# EAGLE design nRF_Wifi_Relay (EAGLE 6.5.0)
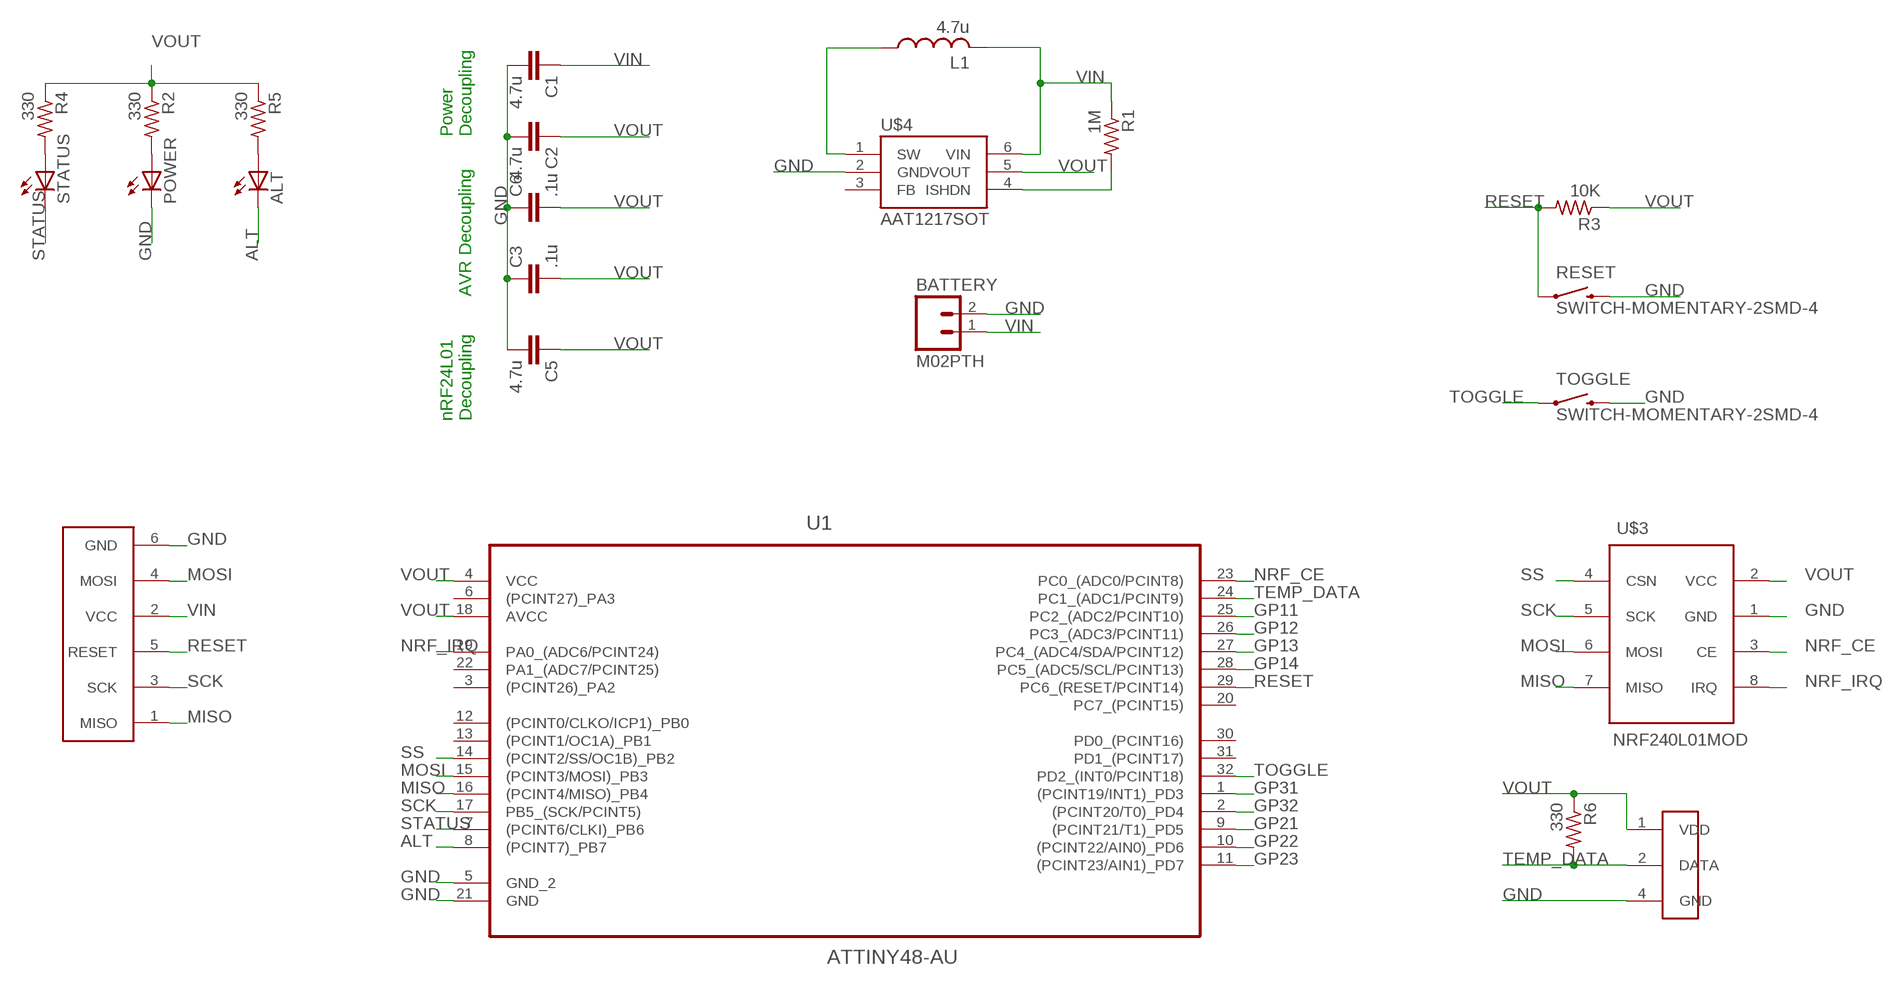
[diagram p0: schematic, sheet 1]

## Parts
ALT  LEDCHIPLED_0603  [CHIPLED_0603]
BATTERY  M02PTH  [1X02]
C1  4.7u  C-EUC0805  [C0805]
C2  4.7u  C-EUC0805  [C0805]
C3  .1u  C-EUC0603  [C0603]
C5  4.7u  C-EUC0805  [C0805]
C6  .1u  C-EUC0603  [C0603]
L1  4.7u  L-USL2825P  [L2825P]
POWER  LEDCHIPLED_0603  [CHIPLED_0603]
R1  1M  R-US_R0805  [R0805]
R2  330  R-US_R0805  [R0805]
R3  10K  R-US_R0603  [R0603]
R4  330  R-US_R0805  [R0805]
R5  330  R-US_R0805  [R0805]
R6  330  R-US_R0805  [R0805]
RESET  SWITCH-MOMENTARY-2SMD-4  [TACTILE_SWITCH_TALL]
STATUS  LEDCHIPLED_0603  [CHIPLED_0603]
TOGGLE  SWITCH-MOMENTARY-2SMD-4  [TACTILE_SWITCH_TALL]
U1  ATTINY48-AU  [QFP80P900X900X120-32N]
U$1  ISP  [ISP]
U$2  DHT11  [DHT11]
U$3  NRF240L01MOD  [NRF240L01MOD]
U$4  AAT1217SOT  [SOT23-6-RIGHT]

## Nets
ALT: ALT.C U1.8((PCINT7)_PB7)
GND: BATTERY.2 C1.2 C2.2 C3.1 C5.2 C6.1 POWER.C RESET.B2 TOGGLE.B2 U1.5(GND_2) U1.21(GND) U$1.6(GND) U$2.4(GND) U$3.1(GND) U$4.2(GND)
GP11: U1.25(PC2_(ADC2/PCINT10))
GP12: U1.26(PC3_(ADC3/PCINT11))
GP13: U1.27(PC4_(ADC4/SDA/PCINT12))
GP14: U1.28(PC5_(ADC5/SCL/PCINT13))
GP21: U1.9((PCINT21/T1)_PD5)
GP22: U1.10((PCINT22/AIN0)_PD6)
GP23: U1.11((PCINT23/AIN1)_PD7)
GP31: U1.1((PCINT19/INT1)_PD3)
GP32: U1.2((PCINT20/T0)_PD4)
MISO: U1.16((PCINT4/MISO)_PB4) U$1.1(MISO) U$3.7(MISO)
MOSI: U1.15((PCINT3/MOSI)_PB3) U$1.4(MOSI) U$3.6(MOSI)
N$1: R4.2 STATUS.A
N$2: POWER.A R2.2
N$3: ALT.A R5.2
N$9: L1.1 U$4.1(SW)
N$10: R1.2 U$4.4(ISHDN)
NRF_CE: U1.23(PC0_(ADC0/PCINT8)) U$3.3(CE)
NRF_IRQ: U1.19(PA0_(ADC6/PCINT24)) U$3.8(IRQ)
RESET: R3.2 RESET.A2 U1.29(PC6_(RESET/PCINT14)) U$1.5(RESET)
SCK: U1.17(PB5_(SCK/PCINT5)) U$1.3(SCK) U$3.5(SCK)
SS: U1.14((PCINT2/SS/OC1B)_PB2) U$3.4(CSN)
STATUS: STATUS.C U1.7((PCINT6/CLKI)_PB6)
TEMP_DATA: R6.2 U1.24(PC1_(ADC1/PCINT9)) U$2.2(DATA)
TOGGLE: TOGGLE.A2 U1.32(PD2_(INT0/PCINT18))
VIN: BATTERY.1 C1.1 L1.2 R1.1 U$1.2(VCC) U$4.6(VIN)
VOUT: C2.1 C3.2 C5.1 C6.2 R2.1 R3.1 R4.1 R5.1 R6.1 U1.4(VCC) U1.18(AVCC) U$2.1(VDD) U$3.2(VCC) U$4.5(VOUT)
Unconnected: U1.3((PCINT26)_PA2) U1.6((PCINT27)_PA3) U1.12((PCINT0/CLKO/ICP1)_PB0) U1.13((PCINT1/OC1A)_PB1) U1.20(PC7_(PCINT15)) U1.22(PA1_(ADC7/PCINT25)) U1.30(PD0_(PCINT16)) U1.31(PD1_(PCINT17)) U$4.3(FB)

## Notes on the sheet
- Power
  Decoupling
- AVR Decoupling
- nRF24L01
  Decoupling

## Library data of the parts
ALT POWER STATUS = led:LED: LED OSRAM: - CHIPLED LG R971, LG N971, LY N971, LG Q971, LY Q971, LO R971, LY R971 LH N974, LH R974 LS Q976, LO Q976, LY Q976 LO Q996 - Hyper CHIPLED LW Q18S LB Q993, LB Q99A, LB R99A - SideLED LS A670, LO A670, LY A670, LG A670, LP A670 LB A673, LV A673, LT A673, LW A673 LH A674 LY A675 LS A676, LA A676, LO A676, LY A676, LW A676 LS A679, LY A679, LG A679 - Hyper Micro SIDELED® LS Y876, LA Y876, LO Y876, LY Y876 LT Y87S - SmartLED LW L88C, LW L88S LB L89C, LB L89S, LG L890 LS L89K, LO L89K, LY L89K LS L896, LA L896, LO L896, LY L896 - TOPLED LS T670, LO T670, LY T670, LG T670, LP T670 LSG T670, LSP T670, LSY T670, LOP T670, LYG T670 LG T671, LOG T671, LSG T671 LB T673, LV T673, LT T673, LW T673 LH T674 LS T676, LA T676, LO T676, LY T676, LB T676, LH T676, LSB T676, LW T676 LB T67C, LV T67C, LT T67C, LS T67K, LO T67K, LY T67K, LW E67C LS E67B, LA E67B, LO E67B, LY E67B, LB E67C, LV E67C, LT E67C LW T67C LS T679, LY T679, LG T679 LS T770, LO T770, LY T770, LG T770, LP T770 LB T773, LV T773, LT T773, LW T773 LH T774 LS E675, LA E675, LY E675, LS T675 LS T776, LA T776, LO T776, LY T776, LB T776 LHGB T686 LT T68C, LB T68C - Hyper Mini TOPLED® LB M676 - Mini TOPLED Santana® LG M470 LS M47K, LO M47K, LY M47K Source: http://www.osram.convergy.de LUXEON: - LUMILED® LXK2-PW12-R00, LXK2-PW12-S00, LXK2-PW14-U00, LXK2-PW14-V00 LXK2-PM12-R00, LXK2-PM12-S00, LXK2-PM14-U00 LXK2-PE12-Q00, LXK2-PE12-R00, LXK2-PE12-S00, LXK2-PE14-T00, LXK2-PE14-U00 LXK2-PB12-K00, LXK2-PB12-L00, LXK2-PB12-M00, LXK2-PB14-N00, LXK2-PB14-P00, LXK2-PB14-Q00 LXK2-PR12-L00, LXK2-PR12-M00, LXK2-PR14-Q00, LXK2-PR14-R00 LXK2-PD12-Q00, LXK2-PD12-R00, LXK2-PD12-S00 LXK2-PH12-R00, LXK2-PH12-S00 LXK2-PL12-P00, LXK2-PL12-Q00, LXK2-PL12-R00 Source: www.luxeon.com KINGBRIGHT: KA-3528ASYC Source: www.kingbright.com
BATTERY = SparkFun-Connectors:M02: Standard 2-pin 0.1" header. Use with - straight break away headers ( PRT-00116) - right angle break away headers (PRT-00553) - swiss pins (PRT-00743) - machine pins (PRT-00117) - female headers (PRT-00115) Molex polarized connector foot print use with: PRT-08233 with associated crimp pins and housings. 2.54_SCREWTERM for use with PRT-10571. 3.5mm Screw Terminal footprints for PRT-08084 5mm Screw Terminal footprints for use with PRT-08433
C1-C3 C5 C6 = resistor:C-EU: CAPACITOR, European symbol
L1 = resistor:L-US: INDUCTOR, American symbol
R1-R6 = resistor:R-US_: RESISTOR, American symbol
RESET TOGGLE = SparkFun-Electromechanical:SWITCH-MOMENTARY-2: Various NO switches- pushbuttons, reed, etc; PROD_ID: SWCH-11966
U1 = Atmel_By_element14_Batch_1-00:ATTINY48-AU: 8-bit Microcontroller; MPN: ATTINY48-AU; OC_FARNELL: 1636953; OC_NEWARK: 68T3768; PACKAGE: QFP-32; SUPPLIER: Atmel
U$1 = custom:ISP
U$2 = custom:DHT11
U$3 = custom:NRF240L01MOD
U$4 = custom:AAT1217: Micropower Synchronous Step-Up Converter

## Board
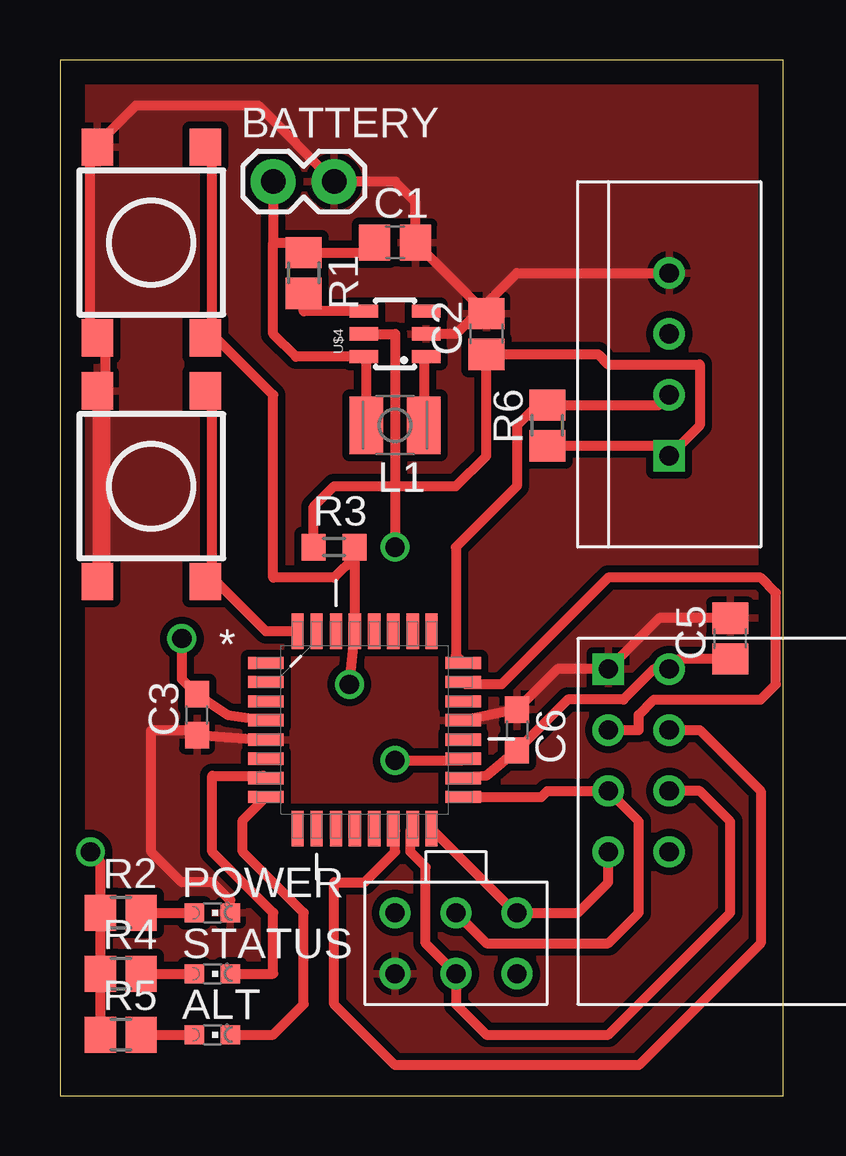
[diagram p1: board, top side]
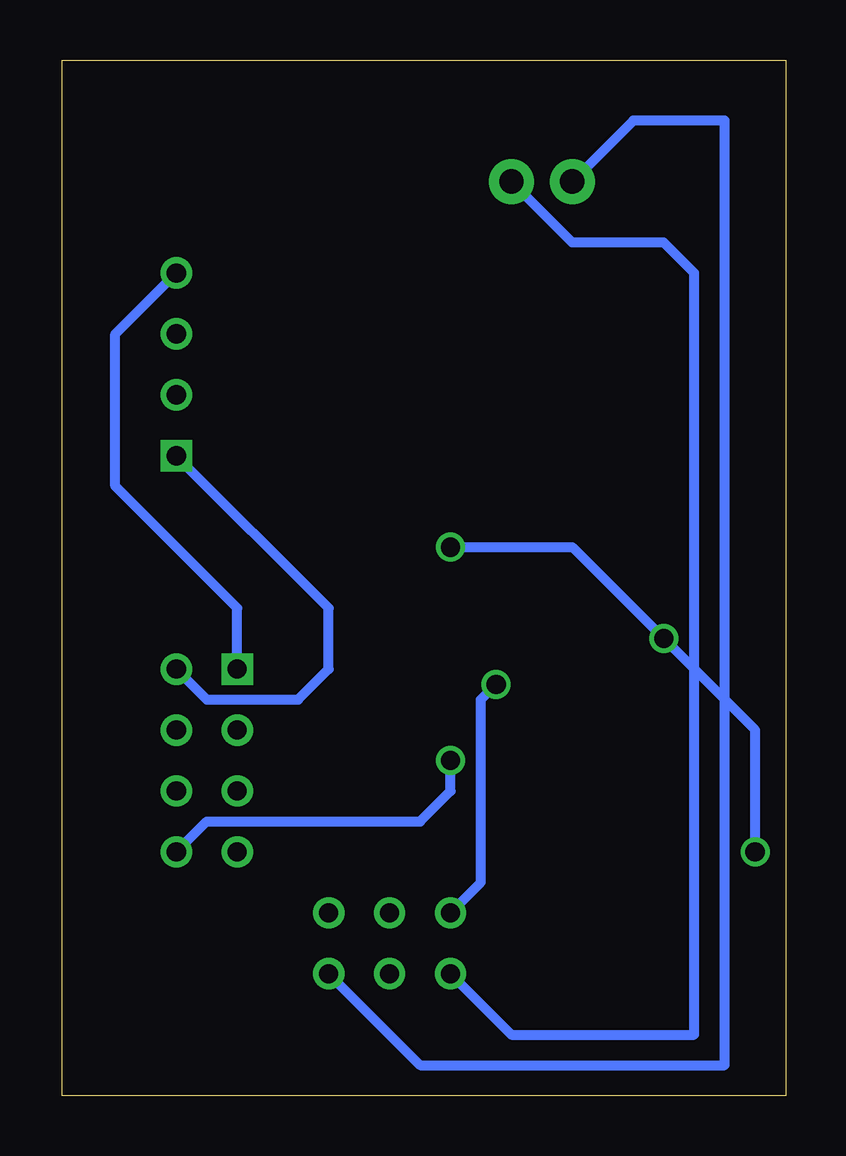
[diagram p2: board, bottom side, seen from below]

Size 30.15 x 43.17 mm. Coordinates in mm from the lower left corner, seen from the top.
Outline: 0,0 30.15,0 30.15,43.17 0,43.17 0,0
Copper layers (1*16): Top 0.035mm / dielectric 1.5mm / Bottom 0.035mm
Design rules "default *": minimum track width 10mil, minimum drill 24mil, track to track 12mil, track to pad 12mil, pad to pad 12mil, via to via 12mil, smd to smd 8mil, copper to edge 40mil, drill to drill 8mil, minimum pad ring 10mil, minimum via ring 8mil, stop-mask expansion 4mil, vias tented up to drill 0mil, thermal gap 10mil

### Footprints (pad centres in the part's own frame; a part is rotated, then mirrored left to right if it is on the bottom)
CHIPLED_0603 = smd 0.8 x 0.8: A 0,-0.75; C 0,0.75
1X02 = drill 1.016 pad 1.88: 1 0,0; 2 2.54,0
C0805 = smd 1.3 x 1.5: 1 -0.85,0; 2 0.85,0
C0603 = smd 1.1 x 1: 1 -0.85,0; 2 0.85,0
L2825P = smd 1.4 x 2.4: 1 -1.2,0; 2 1.2,0
R0805 = smd 1.3 x 1.5: 1 -0.85,0; 2 0.85,0
R0603 = smd 1 x 1.1: 1 -0.85,0; 2 0.85,0
TACTILE_SWITCH_TALL = smd 1.55 x 1.3: A1 -3.975,-2.25; A2 3.975,-2.25; B1 -3.975,2.25; B2 3.975,2.25
QFP80P900X900X120-32N = smd 1.473 x 0.508: 1 -4.115,2.794; 2 -4.115,2.007; 3 -4.115,1.194; 4 -4.115,0.406; 5 -4.115,-0.406; 6 -4.115,-1.194; 7 -4.115,-2.007; 8 -4.115,-2.794; 17 4.115,-2.794; 18 4.115,-2.007; 19 4.115,-1.194; 20 4.115,-0.406; 21 4.115,0.406; 22 4.115,1.194; 23 4.115,2.007; 24 4.115,2.794 | smd 0.508 x 1.473: 9 -2.794,-4.115; 10 -2.007,-4.115; 11 -1.194,-4.115; 12 -0.406,-4.115; 13 0.406,-4.115; 14 1.194,-4.115; 15 2.007,-4.115; 16 2.794,-4.115; 25 2.794,4.115; 26 2.007,4.115; 27 1.194,4.115; 28 0.406,4.115; 29 -0.406,4.115; 30 -1.194,4.115; 31 -2.007,4.115; 32 -2.794,4.115
ISP = drill 0.8: 1 -1.27,1.27; 2 1.27,1.27; 3 -1.27,-1.27; 4 1.27,-1.27; 5 -1.27,-3.81; 6 1.27,-3.81
DHT11 = drill 0.8 square: 1 3.81,-11.43 | drill 0.8: 2 3.81,-8.89; 3 3.81,-6.35; 4 3.81,-3.81
NRF240L01MOD = drill 0.8 square: 1 27.94,-13.97 | drill 0.8: 2 25.4,-13.97; 3 27.94,-11.43; 4 25.4,-11.43; 5 27.94,-8.89; 6 25.4,-8.89; 7 27.94,-6.35; 8 25.4,-6.35
SOT23-6-RIGHT = smd 0.55 x 1.2: 1 -0.95,-1.3; 2 0,-1.3; 3 0.95,-1.3; 4 0.95,1.3; 5 0,1.3; 6 -0.95,1.3

### Placement (x,y rotation side)
ALT  6.35,2.54 270 top
BATTERY  8.89,38.1 0 top
C1  13.97,35.56 0 top
C2  17.78,31.75 90 top
C3  5.71,15.88 90 top
C5  27.94,19.05 90 top
C6  19.05,15.24 270 top
L1  13.97,27.94 180 top
POWER  6.35,7.62 270 top
R1  10.16,34.29 270 top
R2  2.54,7.62 0 top
R3  11.43,22.86 0 top
R4  2.54,5.08 0 top
R5  2.54,2.54 0 top
R6  20.32,27.94 90 top
RESET  3.81,35.56 90 top
STATUS  6.35,5.08 270 top
TOGGLE  3.81,25.4 90 top
U1  12.7,15.24 0 top
U$1  17.78,6.35 270 top
U$2  21.59,38.1 0 top
U$3  50.8,3.81 180 top
U$4  13.97,31.75 90 top

### Tracks (layer width: path | path; a pad name or v marks a point on that pad's centre or on a via)
ALT
  Top 0.406: ALT.C 8.89,2.54 10.16,3.81 10.16,7.62 7.62,10.16 7.62,11.48 U1.8
GND
  Top 0.406: C1.2 14.82,35.14 | C2.2 17.36,32.6 16.51,31.75 U$4.2 | C2.2 17.78,33.02 19.05,34.29 U$2.4 | C1.2 C2.2 | C1.2 14.82,37.25 13.97,38.1 BATTERY.2 8.26,41.27 3.17,41.27 1.27,39.37 1.27,39.24 | U1.5 C3.1 5.5,15.24 3.81,15.24 3.81,10.16 5.08,8.89 6.35,8.89 7.1,8.14 POWER.C | U1.21 C6.1 20.74,17.78 U$3.1 24.98,19.9 C5.2 | TOGGLE.B2 1.56,21.88 1.27,21.59 1.91,21.59 1.91,31.11 1.27,31.75 1.27,39.24 | 1.27,39.24 RESET.B2
  Bottom 0.406: U$3.1 22.86,20.32 27.94,25.4 27.94,31.75 U$2.4 | U$1.6 11.43,2.54 3.81,2.54 3.81,34.29 5.08,35.56 8.89,35.56 BATTERY.2
  pour Top (isolate 0.305): -1.27,43.18 -1.27,0 30.48,0 30.48,43.18
MISO
  Top 0.406: U1.16 19,7.62 U$1.1 21.59,7.62 22.86,8.89 U$3.7
MOSI
  Top 0.406: U1.15 14.61,11.02 14.61,10.16 15.24,9.53 15.24,6.35 U$1.4 16.51,3.81 17.78,2.54 22.86,2.54 27.94,7.62 27.94,11.43 26.67,12.7 U$3.6
N$1
  Top 0.406: R4.2 STATUS.A
N$2
  Top 0.406: R2.2 POWER.A
N$3
  Top 0.406: R5.2 ALT.A
N$9
  Top 0.406: U$4.1 15.17,30.8 L1.1
N$10
  Top 0.406: U$4.4 10.16,32.7 R1.2
NRF_CE
  Top 0.406: U$3.3 24.13,15.24 24.13,15.88 24.77,16.51 29.21,16.51 29.84,17.14 29.84,20.95 29.21,21.59 22.86,21.59 18.41,17.14 16.92,17.14 U1.23
NRF_IRQ  (via drill 0.8)
  Top 0.406: v13.97,13.97 16.74,13.97 U1.19
  Bottom 0.406: U$3.8 24.13,11.43 15.24,11.43 13.97,12.7 v13.97,13.97
RESET  (via drill 0.8)
  Top 0.406: v12.06,17.14 U1.29 12.28,19.37 R3.2 12.28,22.44 11.43,21.59 8.89,21.59 8.89,29.21 6.35,31.75 6.35,39.24 RESET.A2
  Bottom 0.406: U$1.5 12.7,8.89 12.7,16.51 v12.06,17.14
SCK
  Top 0.406: U$1.3 17.78,6.35 22.86,6.35 24.13,7.62 24.13,11.43 U$3.5 20.32,12.7 20.07,12.45 U1.17
SS
  Top 0.406: U$3.4 26.67,15.24 29.21,12.7 29.21,6.35 24.13,1.27 13.97,1.27 11.43,3.81 11.43,8.89 12.7,8.89 13.97,10.16 13.97,11.05 U1.14
STATUS
  Top 0.406: STATUS.C 8.89,5.08 8.89,7.62 6.35,10.16 6.35,13.34 8.48,13.34 U1.7
TEMP_DATA
  Top 0.406: U$2.2 24.98,28.79 R6.2 19.9,28.79 19.05,27.94 19.05,25.4 16.51,22.86 16.51,18.34 U1.24
TOGGLE
  Top 0.406: U1.32 8.59,19.36 6.35,21.59 6.35,29.09 TOGGLE.A2
VIN
  Top 0.406: C1.1 13.12,35.14 R1.1 9.74,35.56 8.89,35.56 | L1.2 12.77,30.8 U$4.6 9.84,30.8 8.89,31.75 8.89,35.56 | BATTERY.1 8.89,35.56
  Bottom 0.406: U$1.2 15.24,1.27 2.54,1.27 2.54,40.64 6.35,40.64 BATTERY.1
VOUT  (via drill 0.8, 0.8 pad 0.61)
  Top 0.406: R6.1 24.98,27.09 U$2.1 26.67,27.94 26.67,30.48 22.86,30.48 22.44,30.9 C2.1 17.78,26.67 16.51,25.4 13.97,25.4 | U$4.5 13.97,31.75 13.97,25.4 | U1.4 6.99,15.88 C3.2 5.08,17.36 v5.08,19.05 | U1.18 17.78,13.34 C6.2 21.17,16.51 23.5,16.51 24.77,17.78 U$3.2 25.82,18.2 C5.1 | R3.1 10.58,24.55 11.43,25.4 13.97,25.4 | 13.97,25.4 v13.97,22.86 | R5.1 R4.1 R2.1 1.69,9.74 v1.27,10.16
  Bottom 0.406: U$3.2 24.13,16.51 20.32,16.51 19.05,17.78 19.05,20.32 U$2.1 | v13.97,22.86 8.89,22.86 v5.08,19.05 1.27,15.24 v1.27,10.16